# Altium schematic sheet [0] Sheet1.SchDoc
size B; Organization: Altium Limited; Address1: L3, 12a Rodborough Rd; Address2: Frenchs Forest; Address3: NSW; Address4: Australia 2086
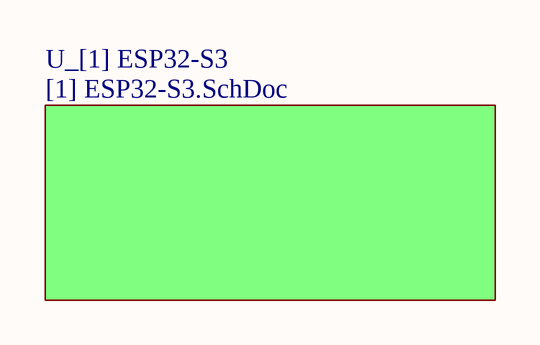
[diagram p0: [0] Sheet1.SchDoc]

## Sub-sheets
U_[1] ESP32-S3 = [1] ESP32-S3.SchDoc: no entries

## Notes on the sheet
- Title
- Size:
- Date:
- B
- Number:
- Time:
- Revision:
- Sheet
- of
- File: